# EAGLE board hsa_stm32_board (EAGLE 6.6.0)
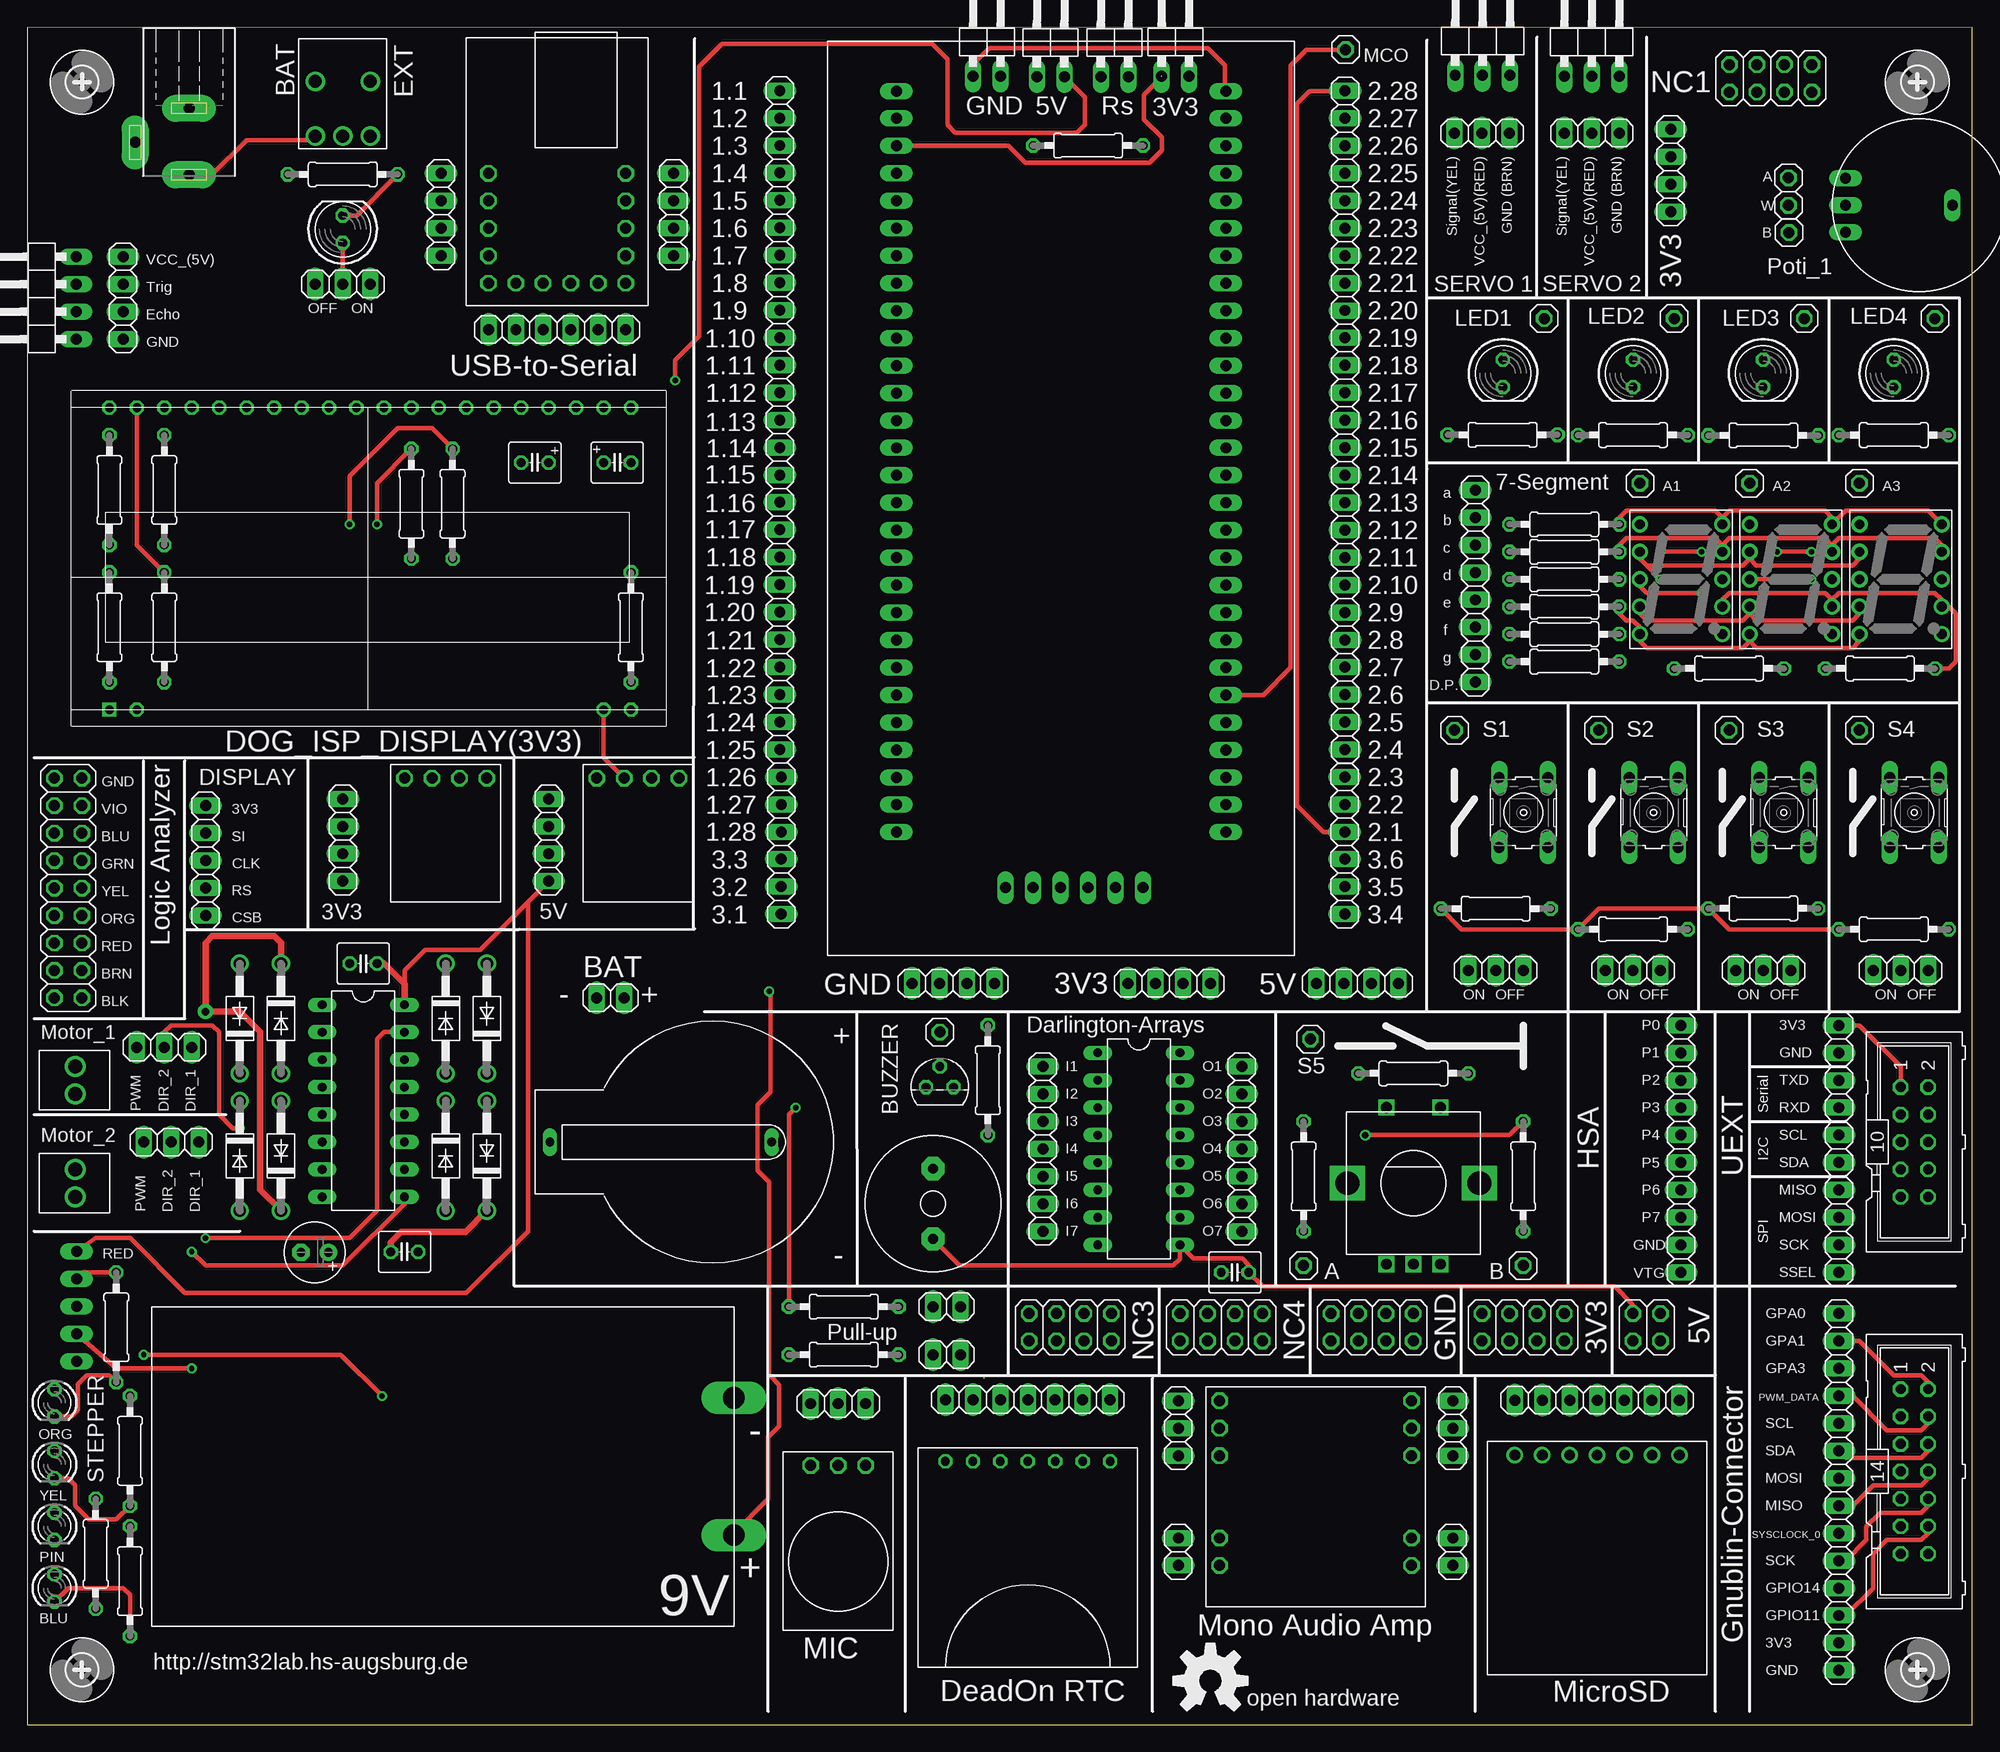
[diagram p3: board, top side]
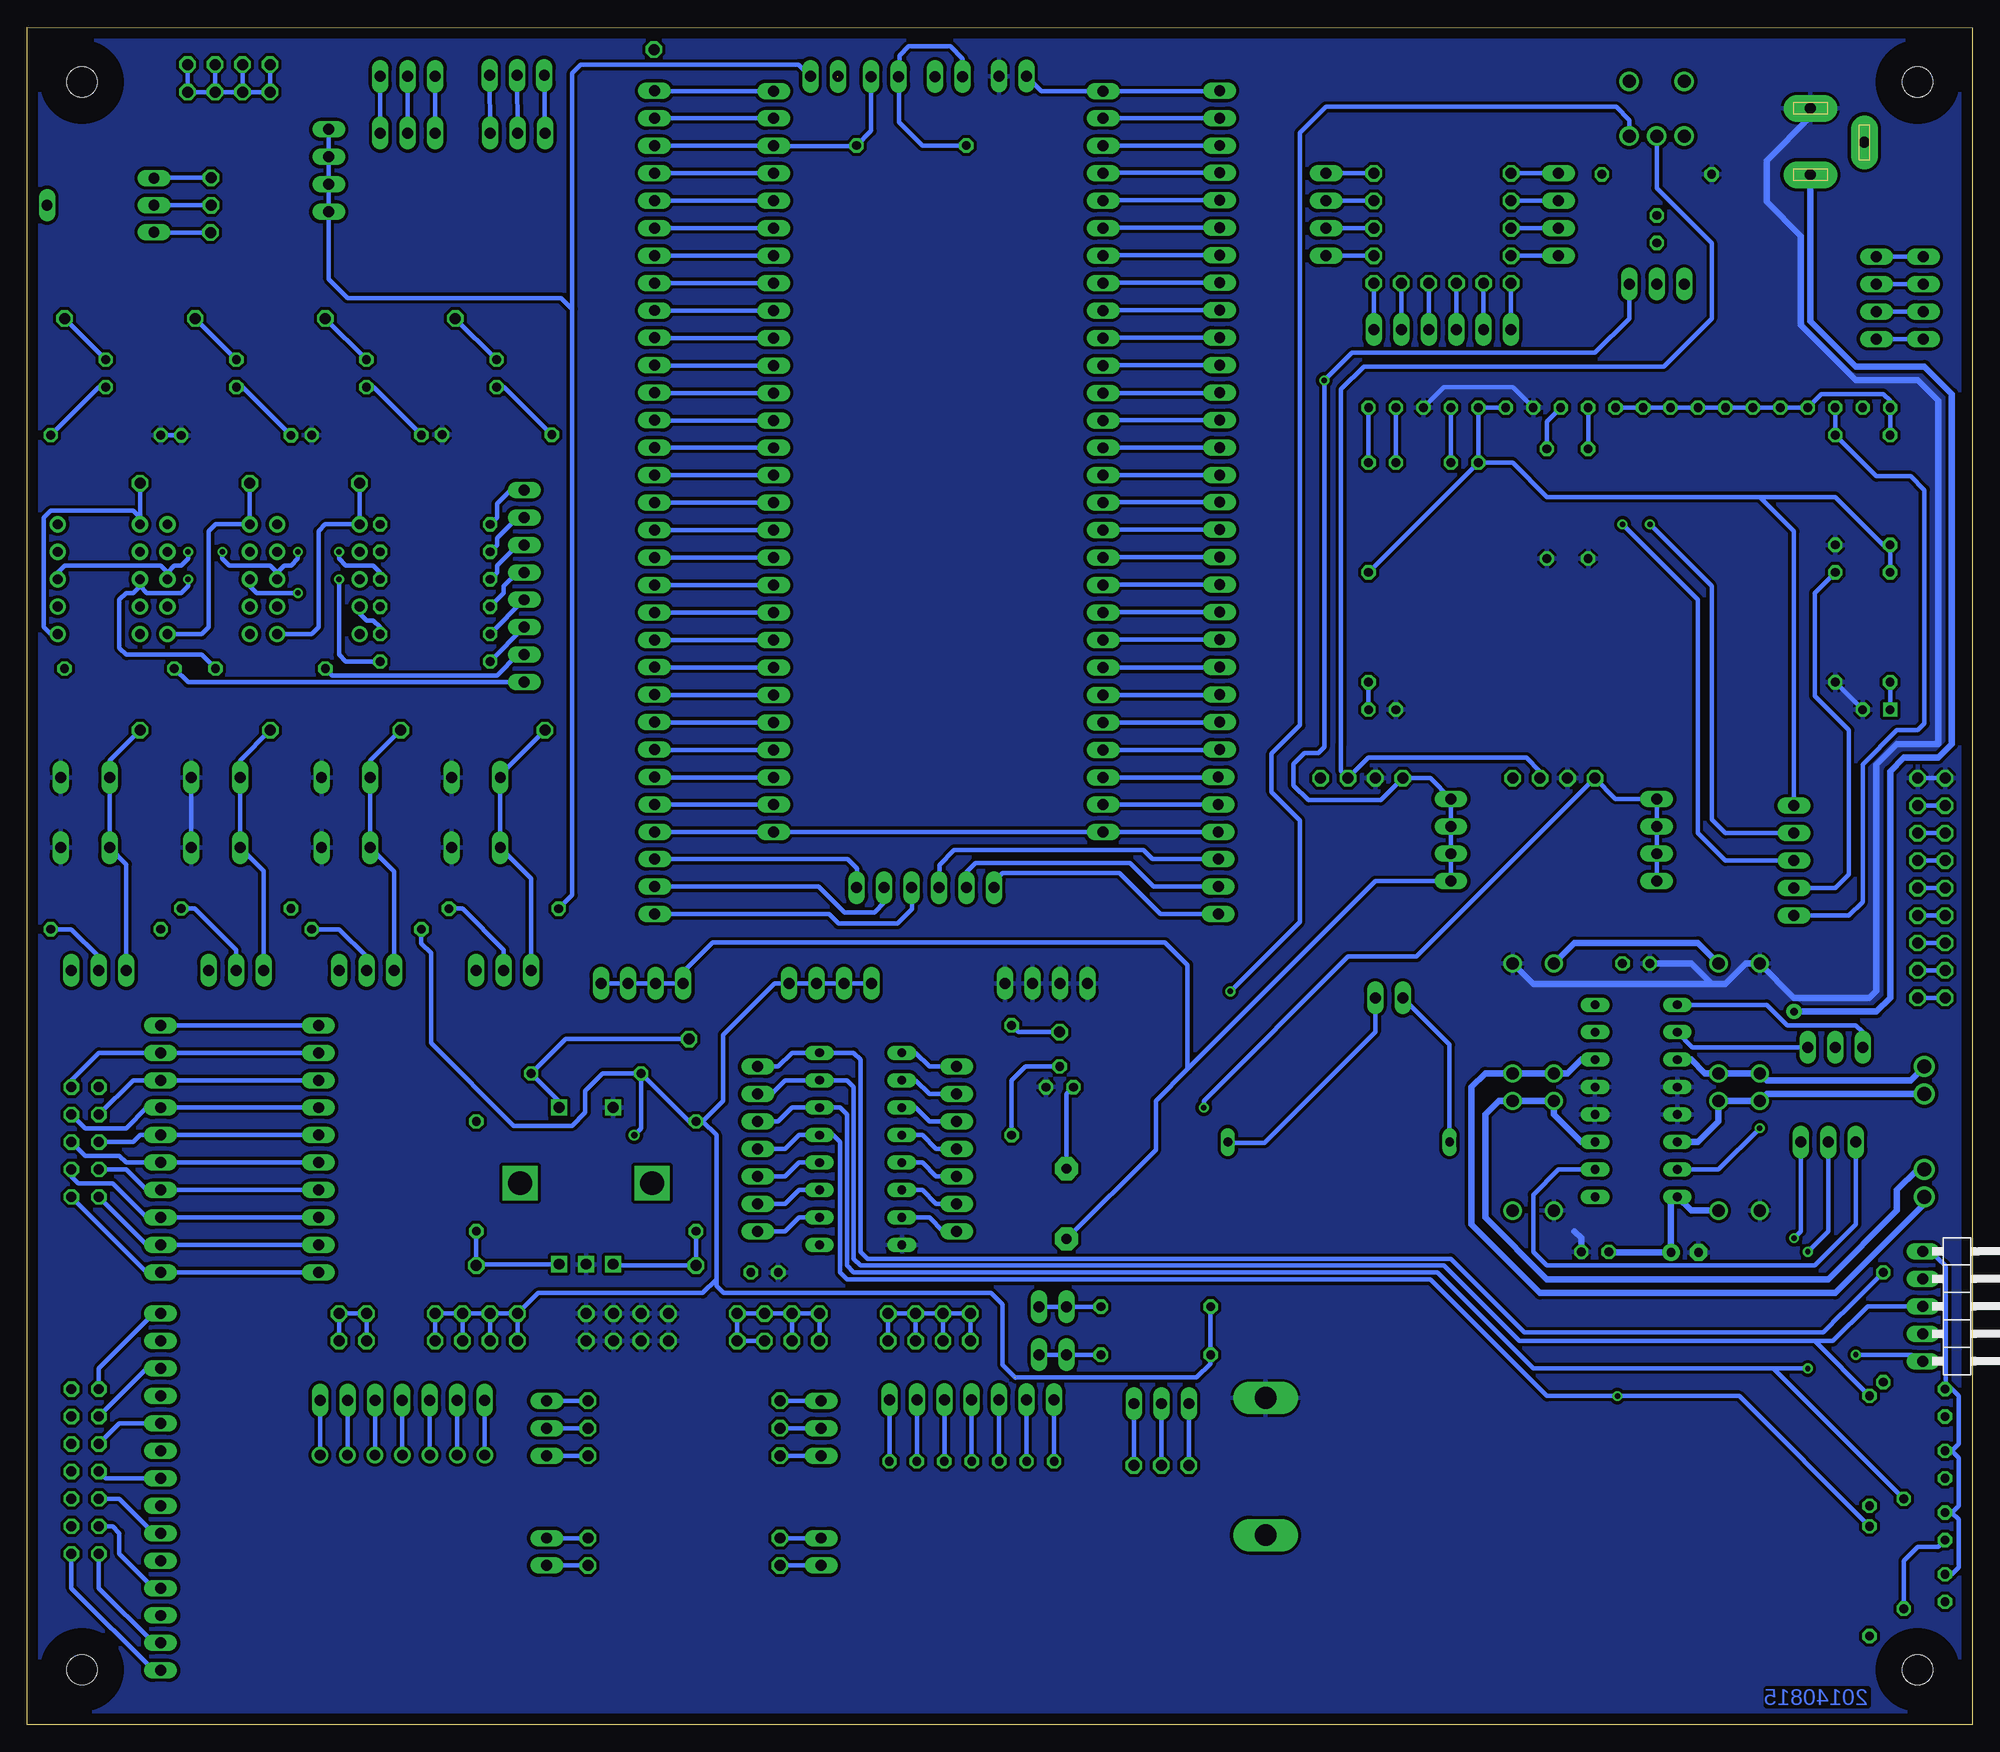
[diagram p4: board, bottom side, seen from below]

Size 180 x 157.08 mm. Coordinates in mm from the lower left corner, seen from the top.
Outline: 0,0 180,0 180,157.08 0,157 0,0
Copper layers (1*16): Top 0.035mm / dielectric 1.5mm / Bottom 0.035mm
Design rules "default *": minimum track width 10mil, minimum drill 0.5mm, track to track 8mil, track to pad 8mil, pad to pad 8mil, via to via 8mil, smd to smd 8mil, copper to edge 40mil, drill to drill 8mil, minimum pad ring 10mil, minimum via ring 8mil, stop-mask expansion 4mil, vias tented up to drill 0mil, thermal gap 10mil

## Footprints (pad centres in the part's own frame; a part is rotated, then mirrored left to right if it is on the bottom)
VOL_REG = drill 1.016 octagon: GND 11.43,6.35; SHDN_N 11.43,1.27; VIN 11.43,3.81; VOUT 11.43,8.89
C025-040X050 = drill 0.813 octagon: 1 -1.27,0; 2 1.27,0
RCL_C025-040X050 = drill 0.813 octagon: 1 -1.27,0; 2 1.27,0
RCL_E2,5-6 = drill 0.813 pad 1.6: + -1.27,0 | drill 0.813 pad 1.6 octagon: - 1.27,0
DO41-10 = drill 1.118: A 5.08,0; C -5.08,0
2,8 = hole 2.8: 0,0
DIL16 = drill 0.813 long: 1 -8.89,-3.81; 2 -6.35,-3.81; 3 -3.81,-3.81; 4 -1.27,-3.81; 5 1.27,-3.81; 6 3.81,-3.81; 7 6.35,-3.81; 8 8.89,-3.81; 9 8.89,3.81; 10 6.35,3.81; 11 3.81,3.81; 12 1.27,3.81; 13 -1.27,3.81; 14 -3.81,3.81; 15 -6.35,3.81; 16 -8.89,3.81
1X05 = drill 1.016 long: 1 -5.08,0; 2 -2.54,0; 3 0,0; 4 2.54,0; 5 5.08,0
1X01 = drill 1.016 octagon: 1 0,0
1X03 = drill 1.016 long: 1 -2.54,0; 2 0,0; 3 2.54,0
1X25 = drill 1.016 long: 1 -29.21,0; 2 -26.67,0; 3 -24.13,0; 4 -21.59,0; 5 -19.05,0; 6 -16.51,0; 7 -13.97,0; 8 -11.43,0; 9 -8.89,0; 10 -6.35,0; 11 -3.81,0; 12 -1.27,0; 13 1.27,0; 14 3.81,0; 15 6.35,0; 16 8.89,0; 17 11.43,0; 18 13.97,0; 19 16.51,0; 20 19.05,0; 21 21.59,0; 22 24.13,0; 23 26.67,0; 24 29.21,0; 25 31.75,0
1X02/90 = drill 1.016 long: 1 -1.27,-3.81; 2 1.27,-3.81
1X10 = drill 1.016 long: 1 -11.43,0; 2 -8.89,0; 3 -6.35,0; 4 -3.81,0; 5 -1.27,0; 6 1.27,0; 7 3.81,0; 8 6.35,0; 9 8.89,0; 10 11.43,0
1X07 = drill 1.016 long: 1 -7.62,0; 2 -5.08,0; 3 -2.54,0; 4 0,0; 5 2.54,0; 6 5.08,0; 7 7.62,0
1X08 = drill 1.016 long: 1 -8.89,0; 2 -6.35,0; 3 -3.81,0; 4 -1.27,0; 5 1.27,0; 6 3.81,0; 7 6.35,0; 8 8.89,0
1X04 = drill 1.016 long: 1 -3.81,0; 2 -1.27,0; 3 1.27,0; 4 3.81,0
1X05/90 = drill 1.016 long: 1 -5.08,-3.81; 2 -2.54,-3.81; 3 0,-3.81; 4 2.54,-3.81; 5 5.08,-3.81
1X04/90 = drill 1.016 long: 1 -3.81,-3.81; 2 -1.27,-3.81; 3 1.27,-3.81; 4 3.81,-3.81
1X02 = drill 1.016 long: 1 -1.27,0; 2 1.27,0
1X06 = drill 1.016 long: 1 -6.35,0; 2 -3.81,0; 3 -1.27,0; 4 1.27,0; 5 3.81,0; 6 6.35,0
2X04 = drill 1.016 octagon: 1 -3.81,-1.27; 2 -3.81,1.27; 3 -1.27,-1.27; 4 -1.27,1.27; 5 1.27,-1.27; 6 1.27,1.27; 7 3.81,-1.27; 8 3.81,1.27
1X03/90 = drill 1.016 long: 1 -2.54,-3.81; 2 0,-3.81; 3 2.54,-3.81
2X09 = drill 1.016 octagon: 1 -10.16,-1.27; 2 -10.16,1.27; 3 -7.62,-1.27; 4 -7.62,1.27; 5 -5.08,-1.27; 6 -5.08,1.27; 7 -2.54,-1.27; 8 -2.54,1.27; 9 0,-1.27; 10 0,1.27; 11 2.54,-1.27; 12 2.54,1.27; 13 5.08,-1.27; 14 5.08,1.27; 15 7.62,-1.27; 16 7.62,1.27; 17 10.16,-1.27; 18 10.16,1.27
1X14 = drill 1.016 long: 1 -16.51,0; 2 -13.97,0; 3 -11.43,0; 4 -8.89,0; 5 -6.35,0; 6 -3.81,0; 7 -1.27,0; 8 1.27,0; 9 3.81,0; 10 6.35,0; 11 8.89,0; 12 11.43,0; 13 13.97,0; 14 16.51,0
2X02 = drill 1.016 octagon: 1 -1.27,-1.27; 2 -1.27,1.27; 3 1.27,-1.27; 4 1.27,1.27
691210910002 = drill 1.3: 1 -2.54,0; 2 0,0
ZEITERFASSUNG_-OPTO_DOGM = drill 0.8 square: 1 0,0 | drill 0.8 octagon: 2 2.54,0; 19 45.72,0; 20 48.26,0; 21 48.26,27.94; 22 45.72,27.94; 23 43.18,27.94; 24 40.64,27.94; 25 38.1,27.94; 26 35.56,27.94; 27 33.02,27.94; 28 30.48,27.94; 29 27.94,27.94; 30 25.4,27.94; 31 22.86,27.94; 32 20.32,27.94; 33 17.78,27.94; 34 15.24,27.94; 35 12.7,27.94; 36 10.16,27.94; 37 7.62,27.94; 38 5.08,27.94; 39 2.54,27.94; 40 0,27.94
LED5MM = drill 0.813 octagon: A -1.27,0; K 1.27,0
LA-401 = drill 0.9 pad 1.5: 1 -3.81,5.08; 2 -3.81,2.54; 3 -3.81,0; 4 -3.81,-2.54; 5 -3.81,-5.08; 6 3.81,-5.08; 7 3.81,-2.54; 8 3.81,0; 9 3.81,2.54; 10 3.81,5.08
LED3MM = drill 0.813 octagon: A -1.27,0; K 1.27,0
0207/10 = drill 0.813 octagon: 1 -5.08,0; 2 5.08,0
CPU-K_MODULE_REV3.0_SWITCH-OMRON_B3F-10XX = drill 1.016 long: 1 -3.251,2.261; 2 3.251,2.261; 3 -3.251,-2.261; 4 3.251,-2.261
BUZZER_F/PMX04A = drill 0.914 pad 2.159 octagon: + 3.251,0; - -3.251,0
CON-HARTING-ML_ML10 = drill 0.914 octagon: 1 -5.08,-1.27; 2 -5.08,1.27; 3 -2.54,-1.27; 4 -2.54,1.27; 5 0,-1.27; 6 0,1.27; 7 2.54,-1.27; 8 2.54,1.27; 9 5.08,-1.27; 10 5.08,1.27
ML14 = drill 0.914 octagon: 1 -7.62,-1.27; 2 -7.62,1.27; 3 -5.08,-1.27; 4 -5.08,1.27; 5 -2.54,-1.27; 6 -2.54,1.27; 7 0,-1.27; 8 0,1.27; 9 2.54,-1.27; 10 2.54,1.27; 11 5.08,-1.27; 12 5.08,1.27; 13 7.62,-1.27; 14 7.62,1.27
ALPS_EC12E_SW = drill 1 square: A -2.5,-7.5; B 2.5,-7.5; C 0,-7.5; D -2.5,7; E 2.5,7 | drill 2.2 square: GND1 -6.1,0; GND2 6.1,0
TRANSISTOR_TO92 = drill 0.813 octagon: 1 1.27,0; 2 0,1.905; 3 -1.27,0
STM32DISCOVERY = drill 1.016 long: 3V3_EXT_VL 11.43,77.08; BOOT0_VL 41.91,69.46; EXT_5V_VL 41.91,77.08; GND_0_L_VL 11.43,82.16; GND_1_L_VL 11.43,13.58; GND_2_R_VL 41.91,82.16; GND_3_R_VL 41.91,13.58; NC_L_VL 11.43,79.62; NC_R_VL 41.91,79.62; PA0_VL 11.43,46.6; PA1_VL 11.43,44.06; PA2_VL 11.43,41.52; PA3_VL 11.43,38.98; PA4_VL 11.43,36.44; PA5_VL 11.43,33.9; PA6_VL 11.43,31.36; PA7_VL 11.43,28.82; PA8_VL 41.91,26.28; PA9_VL 41.91,28.82; PA10_VL 41.91,31.36; PA11_VL 41.91,33.9; PA12_VL 41.91,36.44; PA13_VL 41.91,38.98; PA14_VL 41.91,41.52; PA15_VL 41.91,44.06; PB0_VL 11.43,21.2; PB1_VL 11.43,18.66; PB2_VL 11.43,16.12; PB3_VL 41.91,56.76; PB4_VL 41.91,59.3; PB5_VL 41.91,61.84; PB6_VL 41.91,64.38; PB7_VL 41.91,66.92; PB8_VL 41.91,72; PB9_VL 41.91,74.54; PB10_VL 21.53,8.45; PB11_VL 24.07,8.45; PB12_VL 26.61,8.45; PB13_VL 29.15,8.45; PB14_VL 31.69,8.45; PB15_VL 34.23,8.45; PC0_VL 11.43,56.76; PC1_VL 11.43,54.22; PC2_VL 11.43,51.68; PC3_VL 11.43,49.14; PC4_VL 11.43,26.28; PC5_VL 11.43,23.74; PC6_VL 41.91,16.12; PC7_VL 41.91,18.66; PC8_VL 41.91,21.2; PC9_VL 41.91,23.74; PC10_VL 41.91,46.6; PC11_VL 41.91,49.14; PC12_VL 41.91,51.68; PC13_VL 11.43,72; PC14_VL 11.43,69.46; PC15_VL 11.43,66.92; PD0_VL 11.43,64.38; PD1_VL 11.43,61.84; PD2_VL 41.91,54.22; RESET_VL 11.43,59.3; VBAT_EXT_VL 11.43,74.54
USB_TO_SERIAL = drill 1.016 octagon: 1 12.54,14.75; 2 15.08,14.75; 3 17.62,14.75; 4 20.16,14.75; 5 22.7,14.75; 6 22.7,12.21; 7 22.7,9.67; 8 22.7,7.1; 9 22.7,4.59; 10 22.7,2.05; 11 20.16,2.05; 12 17.62,2.05; 13 15.08,2.05; 14 12.54,2.05
KIPPSCHALTER = drill 1.2: 1 0,0; 2 2.54,0; 3 5.08,0; P$2 0,5.08; P$4 5.08,5.08
MIC = drill 1.016 octagon: 1 1.27,7.62; 2 1.27,5.08; 3 1.27,2.54
BH_KZH_20 = drill 0.8 long: 1 0,24; 2 0,3.5
BATTERIEHALTER_9V = drill 2 long: 1 0,21.135; 2 0,8.435
AUDIO_AMPLIFIER = drill 1.016 octagon: 1 1.27,16.51; 2 1.27,13.97; 3 1.27,6.35; 4 1.27,3.81; 5 1.27,1.27; 6 19.05,16.51; 7 19.05,13.97; 8 19.05,6.35; 9 19.05,3.81; 10 19.05,1.27
RTC = drill 0.8 octagon: 1 2.54,1.27; 2 5.08,1.27; 3 7.62,1.27; 4 10.16,1.27; 5 12.7,1.27; 6 15.24,1.27; 7 17.78,1.27
MIKRO_SD_HALTER = drill 1: 1 20.32,2.54; 2 20.32,5.08; 3 20.32,7.62; 4 20.32,10.16; 5 20.32,12.7; 6 20.32,15.24; 7 20.32,17.78
THUMBWHEEL_POTI = drill 1 long: 1 0,0.6; 2 2.5,0.6; 3 5,0.6; 4 2.5,10.5
733980-62 = drill 1 pad 2.5 long: 1 0,8.57; 2 0,2.42; 3 5,5.57

## Placement (x,y rotation side)
3V3  VOLTAGE_REGULATOR  [VOL_REG]  43.82,76.14 90 top
5V  VOLTAGE_REGULATOR  [VOL_REG]  61.6,76.14 90 top
C2  0.22 u  [C025-040X050]  54.61,116.78 180 top
C3  1 u  [C025-040X050]  46.99,116.78 0 top
C4  100nf  [RCL_C025-040X050]  31.12,70.42 180 top
C5  100nf  [RCL_C025-040X050]  34.93,43.75 0 top
C6  100nf  [RCL_C025-040X050]  111.76,41.85 180 top
C7  100uf  [RCL_E2,5-6]  26.62,43.71 180 top
D1  1N5819  [DO41-10]  42.55,52.64 90 top
D2  1N5819  [DO41-10]  38.74,65.34 270 top
D3  1N5819  [DO41-10]  38.74,52.64 270 top
D4  1N5819  [DO41-10]  42.55,65.34 90 top
D5  1N5819  [DO41-10]  23.5,52.64 90 top
D6  1N5819  [DO41-10]  23.5,65.34 270 top
D7  1N5819  [DO41-10]  19.69,52.64 270 top
D8  1N5819  [DO41-10]  19.69,65.34 90 top
H1  MOUNT-HOLE2.8  [2,8]  174.9,151.98 0 top
H2  MOUNT-HOLE2.8  [2,8]  5.08,151.98 0 top
H3  MOUNT-HOLE2.8  [2,8]  174.9,5.08 0 top
H4  MOUNT-HOLE2.8  [2,8]  5.08,5.08 0 top
IC1  ULN2003AN  [DIL16]  102.87,53.28 270 top
IC2  L293D  [DIL16]  31.12,57.72 270 top
JP1  [1X05]  16.51,79.95 90 top
JP2  [1X01]  118.11,42.48 0 top
JP3  [1X01]  138.43,42.48 0 top
JP4  [1X03]  29.21,133.29 180 top
JP5  [1X01]  140.37,130.11 0 top
JP6  [1X01]  152.41,130.11 0 top
JP7  [1X01]  164.44,130.11 0 top
JP8  [1X01]  176.53,130.11 0 top
JP9  [1X01]  132.08,92.01 0 top
JP10  [1X01]  145.42,92.01 0 top
JP11  [1X01]  157.48,92.01 0 top
JP12  [1X01]  169.55,92.01 0 top
JP13  [1X01]  118.75,63.44 0 top
JP14  [1X25]  121.95,121.97 270 top
JP15  [1X03]  121.92,85.16 270 top
JP16  [1X25]  69.65,119.45 90 top
JP17  [1X01]  84.46,64.07 0 top
JP18  [1X02/90]  94.7,156.3 0 top
JP19  [1X03]  69.79,85.16 90 top
JP20  [1X10]  167.64,53.28 270 top
JP21  [1X07]  112.4,53.28 270 top
JP22  [1X08]  133.99,105.35 90 top
JP23  [1X01]  149.23,114.87 0 top
JP24  [1X04]  8.89,132.02 270 top
JP25  [1X05/90]  0.78,38.71 270 bottom
JP26  [1X07]  93.98,53.28 270 top
JP27  [1X04/90]  0.73,132.02 90 top
JP28  [1X04]  48.26,81.85 90 top
JP29  [1X04]  29.21,81.85 90 top
JP30  [1X03]  75.05,29.71 0 top
JP31  [1X02]  106.52,16 90 top
JP32  [1X02]  131.92,16 270 top
JP33  [1X03]  131.92,27.43 270 top
JP34  [1X03]  106.52,27.43 90 top
JP35  [1X07]  92.59,30.08 0 top
JP36  [1X04]  59.81,139.73 270 top
JP37  [1X04]  38.31,139.73 90 top
JP38  [1X06]  49.04,129.08 180 top
JP39  [1X07]  145.27,30.02 0 top
JP40  [1X04]  123.1,68.59 180 top
JP41  [1X04]  152.08,143.8 270 top
JP42  [1X04]  85.68,68.59 0 top
JP43  [1X02]  53.98,67.25 180 top
JP44  [1X02/90]  88.8,156.35 0 top
JP45  [2X04]  161.33,152.34 0 top
JP46  [1X03]  121.92,77.55 270 top
JP47  [1X04]  105.68,68.59 0 top
JP48  [1X02/90]  106.25,156.33 0 top
JP49  [1X03/90]  134.67,156.41 0 top
JP50  [1X03]  134.62,147.26 180 top
JP51  [1X03/90]  144.78,156.33 0 top
JP52  [1X03]  144.78,147.26 180 top
JP53  [1X01]  163.03,138.07 90 top
JP54  [1X01]  162.97,140.59 90 top
JP55  [1X01]  162.98,143.13 90 top
JP56  [2X09]  3.81,77.41 90 top
JP57  [1X03]  12.7,62.68 0 top
JP58  [1X03]  13.34,53.91 0 top
JP59  [1X03]  173.36,69.79 180 top
JP60  [1X03]  160.66,69.79 180 top
JP61  [1X03]  148.59,69.79 180 top
JP62  [1X03]  135.89,69.79 180 top
JP63  [1X10]  153.04,53.28 270 top
JP64  [1X14]  167.64,21.53 270 top
JP65  [1X02]  85.09,34.23 0 top
JP66  [1X02]  85.09,38.67 0 top
JP67  [2X04]  124.46,36.77 0 top
JP68  [2X04]  96.52,36.77 0 top
JP69  [2X04]  110.49,36.77 0 top
JP70  [2X04]  138.43,36.77 0 top
JP71  [2X02]  149.86,36.77 0 top
JP72  [1X01]  159.39,114.87 0 top
JP73  [1X01]  169.55,114.87 0 top
JP74  [1X03]  69.78,77.54 270 top
JP75  [1X02/90]  100.62,156.3 0 top
K1  691210910002  [691210910002]  4.45,48.83 270 top
K2  691210910002  [691210910002]  4.45,58.36 270 top
LCD1  [ZEITERFASSUNG_-OPTO_DOGM]  7.62,93.92 0 top
LED1  [LED5MM]  136.56,125.03 270 top
LED2  [LED5MM]  148.6,125.03 270 top
LED3  [LED5MM]  160.63,125.03 270 top
LED4  [LED5MM]  172.72,125.03 270 top
LED5  [LED5MM]  29.21,138.37 90 top
LED6  LA-401MD  [LA-401]  163.2,105.98 0 top
LED7  LA-401MD  [LA-401]  173.36,105.98 0 top
LED8  LA-401MD  [LA-401]  153.04,105.98 0 top
LED9  [LED3MM]  2.54,29.78 270 top
LED10  [LED3MM]  2.54,24.07 270 top
LED11  [LED3MM]  2.54,18.35 270 top
LED12  [LED3MM]  2.54,12.64 270 top
LOGO1  OSHW-LOGOL  [OSHW-LOGO-L]  109.49,4.06 0 top
MCO  [1X01]  122,155 0 top
R1  560Ohm  [0207/10]  136.53,119.35 180 top
R2  560Ohm  [0207/10]  148.59,119.32 180 top
R3  560Ohm  [0207/10]  160.66,119.29 180 top
R4  560Ohm  [0207/10]  172.72,119.32 0 top
R5  [0207/10]  98.18,146.11 0 top
R6  1,4K  [0207/10]  29.21,143.45 180 top
R7  1.6  [0207/10]  55.88,101.54 90 top
R8  1,6  [0207/10]  7.62,101.54 90 top
R9  10k  [0207/10]  12.7,101.54 270 top
R10  10k  [0207/10]  7.62,114.24 270 top
R11  10k  [0207/10]  35.56,112.97 90 top
R12  10k  [0207/10]  39.37,112.97 270 top
R13  10k  [0207/10]  12.7,114.24 90 top
R14  10k  [0207/10]  135.89,75.5 180 top
R15  10k  [0207/10]  148.59,73.59 180 top
R16  10k  [0207/10]  160.66,75.53 180 top
R17  10k  [0207/10]  172.72,73.6 180 top
R18  10k  [0207/10]  138.43,50.74 270 top
R19  10k  [0207/10]  118.11,50.74 90 top
R20  10k  [0207/10]  128.27,60.26 0 top
R21  1k  [0207/10]  88.9,59.63 90 top
R22  [0207/10]  75.57,38.67 180 top
R23  [0207/10]  75.57,34.23 180 top
R24  [0207/10]  142.24,111.06 0 top
R25  [0207/10]  142.24,108.52 0 top
R26  [0207/10]  142.24,105.98 0 top
R27  [0207/10]  142.24,103.44 0 top
R28  [0207/10]  142.24,100.9 0 top
R29  [0207/10]  142.24,98.36 0 top
R30  [0207/10]  157.48,97.73 0 top
R31  [0207/10]  171.45,97.73 0 top
R32  [0207/10]  8.26,36.77 270 top
R33  [0207/10]  6.35,15.81 270 top
R34  [0207/10]  9.53,25.34 270 top
R35  [0207/10]  9.53,13.27 270 top
S1  [CPU-K_MODULE_REV3.0_SWITCH-OMRON_B3F-10XX]  138.47,84.39 270 top
S2  [CPU-K_MODULE_REV3.0_SWITCH-OMRON_B3F-10XX]  150.5,84.39 270 top
S3  [CPU-K_MODULE_REV3.0_SWITCH-OMRON_B3F-10XX]  162.54,84.39 270 top
S4  [CPU-K_MODULE_REV3.0_SWITCH-OMRON_B3F-10XX]  174.63,84.39 270 top
SP1  BUZZER_F/PMX04  [BUZZER_F/PMX04A]  83.82,48.2 270 top
SV2  [CON-HARTING-ML_ML10]  174.63,53.91 270 top
SV3  [ML14]  174.63,23.43 270 top
SW1  EC12E_SW  [ALPS_EC12E_SW]  128.27,50.1 0 top
T1  TRANSISTOR_BC337  [TRANSISTOR_TO92]  84.46,58.99 0 top
U$1  STM32DISCOVERY  [STM32DISCOVERY]  69,69 0 top
U$2  USB_TO_SERIAL_ADAPTER  [USB_TO_SERIAL]  40.64,156.08 270 top
U$4  KIPPSCHALTER(EIN,AUS,EIN)  [KIPPSCHALTER]  26.67,146.98 0 top
U$5  MIC  [MIC]  69.97,25.26 270 top
U$6  BATTERIEHALTER  [BH_KZH_20]  72.39,53.91 90 top
U$7  BATTERIEHALTER_9V  [BATTERIEHALTER_9V]  65.41,38.67 180 top
U$9  AUDIO_AMPLIFIER  [AUDIO_AMPLIFIER]  129.38,31.24 180 top
U$10  RTC  [RTC]  102.75,25.63 180 top
U$12  MICRO_SD_HALTER  [MIKRO_SD_HALTER]  155.43,4.62 90 top
U$17  THUMBWHEEL_POTI  [THUMBWHEEL_POTI]  167.65,143.1 270 top
X1  [733980-62]  15,151.98 180 top

## Tracks (layer width: path | path; a pad name or v marks a point on that pad's centre or on a via)
3.3V  (via drill 0.5, 0.6)  (1 unrouted)
  Top 0.406: R17.2 157.5,73.6 R16.2 145.44,75.53 R15.2 132.72,73.59 R14.2 | v123.83,54.55 137.16,54.55 R18.1 | R22.2 70.48,56.45 v71.12,57.09
  Bottom 0.406: JP70.7 JP70.8 JP70.6 | JP70.2 JP70.4 | JP70.4 JP70.6 | JP70.5 JP70.6 | JP70.3 JP70.4 | JP70.1 JP70.2 | R20.1 118.75,55.82 R19.2 117.47,55.82 | R20.1 123.19,55.19 v123.83,54.55 | R22.2 R23.2 70.5,34.21 70.5,33.41 71.79,32.12 88.57,32.12 | JP29.1 JP29.2 JP29.3 JP29.4 33.02,85.67 3V3.VOUT 51.44,71.06 57.78,71.06 71.12,57.73 v71.12,57.09 | 117.47,55.82 116.2,54.55 116.2,41.22 | 116.2,41.22 117.47,39.95 132.72,39.95 JP70.2 | 116.2,41.22 116.2,40.58 115.57,39.95 90.81,39.95 89.75,38.88 89.75,33.3 88.54,32.09 | JP47.1 JP47.2 JP47.3 JP47.4 110.83,68.59 115.59,63.82 115.59,57.7 117.47,55.82 | JP41.1 JP41.2 JP41.3 JP41.4 152.08,133.75 150.34,132.01 130.59,132.01 129.56,130.99 | 129.56,130.99 129.56,76.75 R14.2 | R20.1 126.74,60.27 128.35,58.65 128.35,56.66 129.59,55.42 134.98,55.42 142.62,63.06 142.62,71.39 143.52,72.29 143.52,73.58 R15.2 | 129.56,130.99 129.56,152.82 128.78,153.6 108.6,153.6 JP48.2
3V3_EXT_VL  (1 unrouted)
  Top 0.406: U$1.3V3_EXT_VL 90.81,146.08 92.37,144.53 103.86,144.53 105.01,145.67 105.01,146.86 103.36,148.51 103.36,150.84 105.01,152.49
  Bottom 0.406: JP16.23 80.39,146.12 U$1.3V3_EXT_VL
5V  (via drill 0.5)
  Top 0.406: SP1.+ 86.28,42.48 106.05,42.48 106.68,43.12 IC1.9 107.93,43.14 112.44,43.14 113.03,42.56 C6.1 114.34,40.54 146.9,40.54 148.59,38.85 JP71.2 | 46.35,76.14 46.35,45.66 40.64,39.95 14.61,39.95 9.53,45.02 6.35,45.02 JP25.1 | 46.35,76.14 JP28.1 | 46.35,76.14 41.91,71.69 36.83,71.69 34.92,69.79 34.92,68.52 | v59.97,124.39 59.97,126.27 62.2,128.5 62.2,153.39 64.32,155.51 83.75,155.51 85.15,154.12 85.15,148.05 85.88,147.32 97.12,147.32 97.87,148.06 97.87,150.6 JP18.2
  Top 0.6: C4.1 33.02,70.42 34.92,68.52 IC2.16
  Bottom 0.406: JP71.3 JP71.4 JP71.2 JP71.1 | SP1.+ 75.56,53.2 75.56,57.73 72.63,60.66 | 72.63,60.66 55.24,78.05 JP28.1 JP28.2 JP28.3 JP28.4 50.16,87.57 5V.VOUT 54.74,85.53 61.46,85.53 62.83,86.91 62.83,88.89 61.8,89.91 60.51,89.91 59.97,90.45 v59.97,124.39 57.42,126.94 34.92,126.94 31.75,130.12 JP4.1 | JP25.1 3.81,43.76 3.17,43.12 3.16,43.12 2.49,42.45 2.49,31.64 1.91,31.05 | 1.91,31.05 1.27,30.42 1.27,25.98 1.91,25.34 | 1.91,31.05 LED9.A | LED10.A 1.91,25.34 | 1.91,25.34 1.27,24.7 1.27,20.26 1.91,19.62 | LED11.A 1.91,19.62 | 1.91,19.62 1.27,18.99 1.27,14.54 1.91,13.91 LED12.A | JP40.1 JP40.2 JP40.3 JP40.4 119.29,69.66 116.58,72.36 74.69,72.36 72.63,70.29 72.63,60.66
5V_EXT_VL
  Bottom 0.406: JP14.3 122.04,146.01 122.46,146.01 122.39,146.08 U$1.EXT_5V_VL 110.89,146.06 103.31,146.06 R5.2 101.89,147.48 JP75.2
CLK_DOG  (via drill 0.5)
  Top 0.406: v32.38,111.06 32.38,114.88 R11.2
  Bottom 0.406: R11.2 LCD1.29 | JP1.3 22.86,79.95 25.4,82.49 25.4,104.08 v32.38,111.06
CSB_DOG
  Bottom 0.406: LCD1.38 R13.2 8.89,115.51 5.71,115.51 4.45,114.24 4.45,92.65 5.08,92.02 6.99,92.02 10.16,88.84 10.16,76.14 11.43,74.87 JP1.1
DIR_1_MO_1
  Bottom 0.406: IC2.2 25.91,62.68 JP57.3
DIR_1_MO_2  (via drill 0.5)
  Top 0.406: v16.51,45.02 29.84,45.02 32.38,47.56 32.38,63.44 33.02,64.08 IC2.15
  Bottom 0.406: JP58.3 15.88,45.66 v16.51,45.02
DIR_2_MO_1  (via drill 0.5)
  Top 0.406: v19.68,55.19 19.05,55.19 17.78,56.45 17.78,64.08 17.14,64.71 13.34,64.71 12.7,64.08 JP57.2
  Bottom 0.406: IC2.7 23.5,51.38 v19.68,55.19
DIR_2_MO_2
  Bottom 0.406: JP58.1 10.79,46.3 14.61,42.48 39.37,42.48 40.64,43.76 40.64,48.2 40.63,48.21 40.63,49.04 38.3,51.38 IC2.10 35.56,51.38
GND
  Top 0.406: 5V.GND 53.34,89.47 LCD1.19
  Top 0.6: D3.A 38.73,48.2
  Bottom 0.406: S3.2 S3.1 | LCD1.2 R9.2 | LCD1.27 42.55,123.77 48.9,123.77 LCD1.23 | R3.1 165.76,119.32 R4.1 | JP56.18 JP56.17
  Bottom 0.6: X1.2 15,148.77 19.05,144.72 19.05,140.91 15.88,137.74 15.88,129.48 10.79,124.4 5.08,124.4 3.17,122.5 3.17,90.75 6.99,90.75 8.89,88.84 8.89,67.89 9.53,67.25 16.51,67.25 D8.A 20.95,70.42 22.86,68.52 24.13,68.52 | 24.13,68.52 40.64,68.52 D4.A | 24.13,68.52 26.04,70.42 C4.2 | C5.2 36.2,45.02 36.83,45.66
  pour Bottom (isolate 0.3): -4.28,160.24 194.51,167.48 181.87,-3.12 -4.59,-2.28
GND_BOARD_VL  (via drill 0.6)
  Top 0.406: U$1.GND_2_R_VL 110.84,151.23 110.84,153.54 109.25,155.13 89.01,155.13 87.53,153.66 JP44.1 | v121.95,151.16 118.65,151.16 117.48,149.99 117.48,85.05 119.95,82.58 121.88,82.58 JP15.3
  Bottom 0.406: JP16.25 69.83,151.16 U$1.GND_0_L_VL 86.16,151.16 JP44.1 | JP19.1 69.82,82.58 U$1.GND_1_L_VL U$1.GND_3_R_VL 121.92,82.58 JP15.3 | U$1.GND_2_R_VL v121.95,151.16 JP14.1
GNUB_3V3
  Bottom 0.406: JP64.13 168.28,7.56 173.35,12.64 SV3.13
GNUB_GND
  Bottom 0.406: JP64.14 168.28,5.02 175.9,12.64 SV3.14
GNUB_GPA0
  Bottom 0.406: JP64.1 168.28,38.04 173.35,32.96 SV3.1
GNUB_GPA1
  Top 0.406: SV3.2 175.9,31.69 175.26,32.33 172.72,32.33 169.54,35.5 JP64.2
GNUB_GPA3
  Bottom 0.406: JP64.3 168.91,32.96 SV3.3
GNUB_GPIO11
  Top 0.406: JP64.12 168.28,10.1 170.81,12.64 170.81,15.81 172.09,17.09 175.26,17.09 175.9,17.72 SV3.12
GNUB_GPIO14
  Bottom 0.406: JP64.11 168.28,12.64 171.45,15.81 171.45,17.72 172.09,18.36 SV3.11
GNUB_MISO
  Top 0.406: SV3.8 175.9,22.8 175.26,22.16 170.81,22.16 168.91,20.26 JP64.8
GNUB_MOSI
  Bottom 0.406: JP64.7 172.72,22.8 SV3.7
GNUB_PWM_DATA
  Top 0.406: SV3.4 175.9,27.88 175.26,27.25 172.09,27.25 168.91,30.42 JP64.4
GNUB_SCK
  Top 0.406: JP64.10 168.28,15.18 170.18,17.09 170.18,18.36 171.45,19.62 175.26,19.62 175.9,20.26 SV3.10
GNUB_SCL
  Bottom 0.406: JP64.5 171.45,27.88 SV3.5
GNUB_SDA
  Top 0.406: SV3.6 175.9,25.34 175.26,24.7 168.28,24.7 JP64.6
GNUB_SYSCLOCK_0
  Bottom 0.406: JP64.9 168.28,17.72 171.45,20.89 SV3.9
MCO_VL
  Top 0.406: U$1.PA8_VL 114.39,95.28 116.9,97.8 116.9,153.52 118.37,154.98 121.98,154.98 MCO.1
  Bottom 0.406: U$1.PA8_VL 121.95,95.28 JP14.23
MOTOR_VCC  (via drill 0.7 pad 1.4)
  Top 0.406: X1.1 17.11,143.41 20.32,146.62 26.32,146.62 U$4.1
  Top 0.6: D6.C 23.5,72.33 22.86,72.97 17.14,72.97 16.51,72.33 v16.51,65.98 19.68,65.98 21.59,64.08 21.59,49.47 D5.C | D1.C 40.57,45.59 34.63,45.59 33.66,44.61 C5.1
  Bottom 0.406: 33.66,43.71 C5.1
  Bottom 0.6: X1.1 15,129.88 10.79,125.67 4.45,125.67 1.91,123.13 1.91,90.75 3.17,89.47 6.35,89.47 7.62,88.2 7.62,67.25 8.89,65.98 v16.51,65.98 | D2.C 36.83,72.33 25.4,72.33 D6.C | D5.C 26.04,47.56 IC2.8 27.89,48.25 C7.+ 33.66,43.71
N$1
  Bottom 0.406: C2.2 LCD1.22
N$2
  Bottom 0.406: C2.1 LCD1.21
N$3
  Bottom 0.406: LCD1.20 R7.1
N$4
  Bottom 0.406: R10.1 LCD1.40 7.62,122.5 8.26,123.13 13.97,123.13 LCD1.37 LCD1.36 LCD1.35 LCD1.34 LCD1.33 LCD1.32 LCD1.31 LCD1.30
N$5
  Bottom 0.406: LCD1.1 R8.1
N$6
  Bottom 0.406: C3.2 LCD1.24
N$7
  Bottom 0.406: R4.2 173.35,123.77 LED4.K
N$8
  Bottom 0.406: R3.2 160.04,123.77 LED3.K
N$9
  Bottom 0.406: R2.2 147.95,123.77 LED2.K
N$10
  Bottom 0.406: R1.2 135.85,123.77 LED1.K
N$11
  Bottom 0.406: JP18.1 93.43,154.16 94.55,155.28 98.44,155.28 99.29,154.43 99.29,152.54 JP75.1 99.33,152.47 99.33,148.29 97.16,146.11 R5.1
N$12
  Bottom 0.406: SW1.A 125.77,42.48 JP2.1 R19.1
N$13
  Bottom 0.406: LED2.A JP6.1
N$14
  Bottom 0.406: LED3.A JP7.1
N$15
  Bottom 0.406: LED4.A JP8.1
N$16
  Bottom 0.406: 3V3.VIN 40.01,88.2 41.27,89.47 55.88,89.47 5V.VIN 58.46,88.24 58.46,90.68 58.42,90.72 58.42,123.56 56.31,125.67 28.57,125.67 24.13,130.12 24.13,137.1 29.21,142.18 U$4.2
N$17
  Top 0.406: R32.2 7.61,32.34 5.53,32.34 4.7,31.51 4.7,29.1 4.12,28.52 2.55,28.52 LED9.K
N$18
  Bottom 0.406: JP62.2 135.89,71.69 139.7,75.5 R14.1
N$19
  Bottom 0.406: JP61.2 148.59,71.06 151.13,73.6 R15.1
N$20
  Bottom 0.406: JP9.1 136.21,87.89 S1.3 S1.4 133.35,78.29 JP62.3
N$21
  Bottom 0.406: JP10.1 148.24,89.19 S2.3 S2.4 146.05,78.95 JP61.3
N$22
  Bottom 0.406: JP60.2 160.66,71.69 164.47,75.5 165.71,75.5 R16.1
N$23
  Bottom 0.406: R17.1 175.9,73.6 173.35,71.06 JP59.2
N$24
  Bottom 0.406: JP11.1 160.28,89.22 S3.3 S3.4 158.12,78.98 JP60.3
N$25
  Bottom 0.406: JP12.1 172.37,89.2 S4.3 S4.4 170.81,79.59 JP59.3
N$26
  Top 0.406: R34.2 8.26,18.99 5.71,18.99 4.45,20.26 4.45,22.16 3.81,22.8 LED10.K
N$27  (via drill 0.5)
  Top 0.406: U$7.1 65.41,17.72 68.58,20.89 68.58,26.6 69.59,27.61 69.59,31.46 68.64,32.4 68.64,50.23 67.6,51.27 67.6,57.35 68.81,58.57 68.81,67.7 v68.66,67.85 68.64,67.83
  Bottom 0.406: v68.66,67.85 62.23,74.28 62.23,83.67 64.86,86.3 64.86,89.84 62.22,92.48 62.22,147.3 | 62.24,147.28 62.22,147.3 | 62.22,147.3 59.83,149.68 32.97,149.68 31.75,148.47 U$4.3
N$28
  Top 0.406: LED5.K 30.48,139.64 R6.1
N$29
  Top 0.406: JP4.2 LED5.A
N$30
  Bottom 0.406: LED1.A JP5.1
N$31
  Bottom 0.406: SW1.B 138.43,42.6 | 138.43,42.6 JP3.1 | 138.43,42.6 R18.2
N$32
  Bottom 0.406: SW1.E 130.77,57.69 R20.2 130.18,63.44 JP13.1
N$33
  Bottom 0.406: U$1.NC_R_VL 121.95,148.62 JP14.2
N$35
  Bottom 0.406: U$1.PB9_VL 121.95,143.54 JP14.4
N$36
  Bottom 0.406: SP1.- 83.82,58.36 T1.3
N$37
  Bottom 0.406: JP43.1 55.24,64.1 55.31,64.04 65.5,53.84 68.81,53.84 U$6.2
N$38
  Bottom 0.6: K1.2 4.45,48.2 12.7,39.95 40.01,39.95 46.35,46.3 46.35,58.99 45.09,60.27 D4.C D2.A 37.47,60.27 36.2,61.53 IC2.14
N$39
  Bottom 0.406: JP17.1 88.27,64.08 R21.2
N$40
  Bottom 0.406: U$6.1 48.39,62.94 JP43.2
N$41
  Bottom 0.406: IC1.12 108.58,52.01 109.86,50.74 JP21.5
N$42
  Bottom 0.406: IC1.11 108.58,49.47 109.86,48.2 JP21.6
N$43
  Bottom 0.406: IC1.10 108.58,46.93 109.86,45.66 JP21.7
N$44
  Bottom 0.406: JP26.5 95.89,50.74 97.16,52.01 IC1.5
N$45
  Top 0.406: JP25.2 5.19,41.85 R32.1
  Bottom 0.406: JP21.1 110.49,60.9 109.22,62.17 IC1.16 103.5,62.17 102.87,61.53 102.87,43.76 102.23,43.12 48.26,43.12 41.45,36.31 13.8,36.31 12.07,38.04 12.06,38.04 R32.1
N$46
  Bottom 0.406: 113.03,58.36 JP21.2 111.12,58.36 109.86,59.63 IC1.15 104.14,59.63 103.5,58.99 103.5,43.12 102.87,42.48 48.9,42.48 41.91,35.5 14.61,35.5 | R34.1 14.61,35.5 | 14.61,35.5 12.9,35.5 9.7,38.7 JP25.3
N$47
  Bottom 0.406: JP26.6 95.89,48.2 97.16,49.47 IC1.6
N$48
  Bottom 0.406: JP26.7 95.25,45.66 96.52,46.93 IC1.7
N$49
  Bottom 0.406: JP56.2 JP56.1
N$50
  Bottom 0.406: JP56.4 JP56.3
N$51  (via drill 0.5)
  Top 0.406: JP25.4 8.26,32.96 v15.24,32.96
  Bottom 0.406: JP21.3 110.49,55.82 109.22,57.09 IC1.14 104.78,57.09 104.14,56.45 104.14,42.48 103.5,41.85 49.53,41.85 40.64,32.96 18.41,32.96 | R33.1 18.41,32.96 | v15.24,32.96 18.41,32.96
N$52  (via drill 0.5)
  Top 0.406: v10.79,34.23 29.03,34.23 v32.85,30.41
  Bottom 0.406: JP21.4 109.86,53.28 108.58,54.55 IC1.13 105.41,54.55 104.78,53.91 104.78,41.85 104.14,41.22 50.16,41.22 39.36,30.41 v32.85,30.41 32.84,30.42 21.59,30.42 R35.1 | JP25.5 5.71,34.23 v10.79,34.23
N$53
  Bottom 0.406: JP56.6 JP56.5
N$54
  Bottom 0.406: JP26.4 95.89,53.28 97.16,54.55 IC1.4
N$55
  Bottom 0.406: JP26.3 96.52,55.82 97.79,57.09 IC1.3
N$56
  Bottom 0.406: JP26.2 96.52,58.36 97.79,59.63 IC1.2
N$57
  Bottom 0.406: JP26.1 96.52,60.9 97.79,62.17 IC1.1
N$58
  Bottom 0.406: JP27.1 JP24.4
N$59
  Bottom 0.406: JP56.8 JP56.7
N$60
  Bottom 0.406: JP56.10 JP56.9
N$61
  Bottom 0.406: JP56.12 JP56.11
N$62
  Bottom 0.406: JP27.2 JP24.3
N$63
  Bottom 0.406: JP27.3 JP24.2
N$64
  Bottom 0.406: JP27.4 JP24.1
N$65
  Bottom 0.406: JP32.2 U$9.1
N$66
  Bottom 0.406: JP32.1 U$9.2
N$67
  Bottom 0.406: U$9.6 JP31.1
N$68
  Bottom 0.406: U$9.7 JP31.2
N$69
  Bottom 0.406: U$9.8 JP34.1
N$70
  Bottom 0.406: JP49.3 JP50.1
N$71
  Bottom 0.406: JP49.2 JP50.2
N$72
  Bottom 0.406: JP50.3 JP49.1
N$73
  Bottom 0.406: JP30.1 U$5.3
N$74
  Bottom 0.406: U$5.2 JP30.2
N$75
  Bottom 0.406: U$5.1 JP30.3
N$76
  Bottom 0.406: U$9.9 JP34.2
N$77
  Bottom 0.406: U$9.10 JP34.3
N$78
  Bottom 0.406: JP33.3 U$9.3
N$79
  Bottom 0.406: JP33.2 U$9.4
N$80
  Bottom 0.406: JP33.1 U$9.5
N$81
  Bottom 0.406: U$10.7 JP35.1
N$82
  Bottom 0.406: U$10.6 JP35.2
N$83
  Bottom 0.406: U$10.5 JP35.3
N$84
  Bottom 0.406: U$10.4 JP35.4
N$85
  Bottom 0.406: JP35.5 U$10.3
N$86
  Bottom 0.406: U$10.2 JP35.6
N$87
  Bottom 0.406: JP35.7 U$10.1
N$88
  Bottom 0.406: U$2.1 JP36.1
N$89
  Bottom 0.406: U$2.2 JP36.2
N$90
  Bottom 0.406: U$2.3 JP36.3
N$91
  Bottom 0.406: U$2.4 JP36.4
N$92
  Bottom 0.406: JP37.1 U$2.11
N$93
  Bottom 0.406: JP37.2 U$2.12
N$94
  Bottom 0.406: JP37.3 U$2.13
N$95
  Bottom 0.406: JP37.4 U$2.14
N$96
  Bottom 0.406: JP38.1 U$2.5
N$97
  Bottom 0.406: JP38.2 U$2.6
N$98
  Bottom 0.406: JP38.3 U$2.7
N$99
  Bottom 0.406: JP38.4 47.77,133.35 U$2.8
N$100
  Bottom 0.406: JP38.5 U$2.9
N$101
  Bottom 0.406: JP38.6 U$2.10
N$102
  Bottom 0.406: U$12.7 JP39.1
N$103
  Bottom 0.406: U$12.6 JP39.2
N$104
  Bottom 0.406: U$12.5 JP39.3
N$105
  Bottom 0.406: U$12.4 JP39.4
N$106
  Bottom 0.406: U$12.3 JP39.5
N$107
  Bottom 0.406: U$12.2 JP39.6
N$108
  Bottom 0.406: U$12.1 JP39.7
N$109
  Bottom 0.406: JP51.3 JP52.1
N$110
  Bottom 0.406: JP51.2 JP52.2
N$111
  Bottom 0.406: JP51.1 JP52.3
N$112
  Bottom 0.406: T1.2 87.63,60.9 88.9,59.63 R21.1
N$113
  Bottom 0.6: IC2.11 36.2,53.91 38.73,56.45 D3.C D1.A 43.81,57.73 45.09,56.45 45.09,46.93 39.37,41.22 13.34,41.22 6.99,47.56 6.99,49.47 5.08,51.38 K1.1
N$114
  Bottom 0.406: JP55.1 168.21,143.13 U$17.1
N$115
  Bottom 0.406: JP54.1 U$17.2
N$116
  Bottom 0.6: K2.1 5.71,59.63 19.05,59.63 D8.C D6.A 24.77,60.27 26.04,61.53 IC2.3
N$117
  Bottom 0.6: IC2.6 25.4,53.91 23.5,55.82 D5.A D7.C 19.05,58.36 K2.2
N$118
  Bottom 0.406: JP53.1 168.22,138.07 U$17.3
N$119
  Top 0.406: LED12.K 3.81,12.64 8.89,12.64 9.53,12.01 R35.2
N$120
  Bottom 0.406: LED11.K 3.17,16.45 5.08,16.45 6.35,15.18 R33.2
N$121
  Bottom 0.406: U$1.PB8_VL 121.95,141 JP14.5
N$122
  Bottom 0.406: JP56.14 JP56.13
N$123
  Bottom 0.406: JP56.16 JP56.15
N$125
  Bottom 0.406: R23.1 JP65.1 JP65.2
N$126
  Bottom 0.406: R22.1 JP66.1 JP66.2
N$127
  Bottom 0.406: R24.1 136.53,111.7 136.53,112.97 135.25,114.24 JP22.8
N$129
  Bottom 0.406: U$1.BOOT0_VL 121.95,138.46 JP14.6
N$130
  Bottom 0.406: U$1.PB7_VL 121.95,135.92 JP14.7
N$131
  Top 0.406: R25.2 147.32,109.16 147.96,109.8 156.21,109.8 156.84,109.16 | LED7.9 177.16,109.16 176.53,109.8 167.64,109.8 167,109.16 | 167,109.16 LED6.9 | LED8.9 156.84,109.16 | 156.84,109.16 157.48,109.8 166.37,109.8 167,109.16
N$132
  Bottom 0.406: JP45.8 JP45.7 JP45.5 | JP45.5 JP45.3 | JP45.3 JP45.1 JP45.2 | JP45.6 JP45.5 | JP45.4 JP45.3
N$133  (via drill 0.5)
  Top 0.406: v165.1,108.53 v161.93,108.53 | v154.94,108.53 v151.13,108.53
  Bottom 0.406: LED7.8 177.16,106.62 176.53,107.25 167.64,107.25 167,106.62 | LED6.8 167,106.62 | 156.84,106.62 157.48,107.25 161.29,107.25 161.93,107.89 v161.93,108.53 | 156.84,106.62 LED8.8 | v165.1,108.53 165.1,107.89 165.74,107.25 166.37,107.25 167,106.62 | 156.84,106.62 156.21,107.25 155.57,107.25 154.94,107.89 v154.94,108.53 | v151.13,108.53 151.13,107.89 150.5,107.25 147.96,107.25 147.32,106.62 R26.2
N$134
  Top 0.406: 159.38,100.27 158.75,99.64 149.86,99.64 149.22,100.27 LED8.5 149.22,101.54 148.59,102.17 147.96,102.17 147.32,102.81 R27.2 | LED6.5 159.38,100.27 | 159.38,100.27 160.02,99.64 168.91,99.64 169.54,100.27 LED7.5
N$135
  Top 0.406: 159.38,102.81 160.02,102.17 168.91,102.17 169.54,102.81 LED7.4 | 159.38,102.81 LED6.4 | LED8.4 149.22,102.81 149.86,102.17 158.75,102.17 159.38,102.81
  Bottom 0.406: R28.2 147.32,101.54 147.96,102.17 148.59,102.17 149.22,102.81 LED8.4
N$136
  Bottom 0.406: JP68.3 JP68.4 | JP68.1 JP68.2 JP68.4 | JP68.7 JP68.8 JP68.6 | JP68.4 JP68.6 | JP68.5 JP68.6
N$137
  Bottom 0.406: U$1.PB6_VL 121.95,133.38 JP14.8
N$138
  Bottom 0.406: U$1.PB5_VL 121.95,130.84 JP14.9
N$139  (via drill 0.5)
  Top 0.406: LED7.2 169.54,107.89 168.91,107.25 160.02,107.25 159.38,107.89 | 159.38,107.89 LED6.2 | LED8.2 149.22,107.89 149.86,107.25 | 149.86,107.25 158.75,107.25 159.38,107.89 | v151.13,105.98 149.86,107.25
  Bottom 0.406: v151.13,105.98 151.13,99 150.5,98.36 R29.2
N$140
  Bottom 0.406: JP69.4 JP69.2 JP69.1 | JP69.4 JP69.3 | JP69.4 JP69.6 JP69.8 JP69.7 JP69.5
N$141  (via drill 0.5)
  Top 0.406: v165.1,105.98 LED6.3 | v154.94,104.72 149.86,104.72 149.22,105.35 LED8.3
  Bottom 0.406: LED7.3 169.54,105.35 | 169.54,105.35 168.91,104.72 165.74,104.72 165.1,105.35 v165.1,105.98 | LED6.3 159.38,105.35 158.75,104.72 v154.94,104.72 | R30.2 163.83,99 170.81,99 171.45,99.64 171.45,104.08 170.81,104.72 170.18,104.72 169.54,105.35
N$142
  Top 0.406: 167,104.08 167.64,104.72 176.53,104.72 177.16,104.08 LED7.7 177.8,103.44 178.44,102.81 178.44,98.36 177.8,97.73 R31.2 | LED6.7 167,104.08 | 167,104.08 166.37,104.72 157.48,104.72 156.84,104.08 LED8.7
N$143
  Top 0.406: R24.2 147.32,111.7 147.96,112.33 156.21,112.33 156.84,111.7 | LED8.10 156.84,111.7 | 156.84,111.7 157.48,112.33 166.37,112.33 167,111.7 LED6.10 168.28,112.33 175.9,112.33 LED7.10
N$144
  Bottom 0.406: R25.1 136.53,109.16 136.53,109.8 134.62,111.7 JP22.7
N$145
  Bottom 0.406: R26.1 136.53,106.62 136.53,107.25 134.62,109.16 JP22.6
N$146
  Bottom 0.406: R27.1 135.89,104.72 135.89,105.35 134.62,106.62 JP22.5
N$147
  Bottom 0.406: R28.1 JP22.4
N$148
  Bottom 0.406: R29.1 JP22.3
N$149
  Bottom 0.406: R30.1 151.76,97.09 136.53,97.09 134.62,99 JP22.2
N$150
  Bottom 0.406: R31.1 165.1,96.46 JP22.1
N$151
  Bottom 0.406: JP72.1 LED6.1 162.56,111.06 163.19,110.43 163.19,101.54 163.83,100.91 LED6.6
N$152
  Bottom 0.406: JP73.1 169.54,111.7 | 169.54,111.7 LED7.1 | LED7.6 177.8,100.91 178.44,101.54 178.44,111.7 177.8,112.33 170.18,112.33 169.54,111.7
N$153
  Bottom 0.406: JP23.1 LED8.1 152.4,111.06 153.03,110.43 153.03,101.54 153.67,100.91 LED8.6
N$154
  Bottom 0.406: U$1.PB4_VL 121.95,128.3 JP14.10
N$155
  Bottom 0.406: U$1.PB3_VL 121.95,125.76 JP14.11
N$156
  Bottom 0.406: U$1.PD2_VL 121.95,123.22 JP14.12
N$157
  Bottom 0.406: U$1.PC12_VL 121.95,120.68 JP14.13
N$158
  Bottom 0.406: U$1.PC11_VL 121.95,118.14 JP14.14
N$159
  Bottom 0.406: U$1.PC10_VL 121.95,115.6 JP14.15
N$160
  Bottom 0.406: U$1.PA15_VL 121.95,113.06 JP14.16
N$161
  Bottom 0.406: U$1.PA14_VL 121.95,110.52 JP14.17
N$162
  Bottom 0.406: U$1.PA13_VL 121.95,107.98 JP14.18
N$163
  Bottom 0.406: U$1.PA12_VL 121.95,105.44 JP14.19
N$164
  Bottom 0.406: U$1.PA11_VL 121.95,102.9 JP14.20
N$165
  Bottom 0.406: U$1.PA10_VL 121.95,100.36 JP14.21
N$166
  Bottom 0.406: U$1.PA9_VL 121.95,97.82 JP14.22
N$168
  Bottom 0.406: U$1.PC9_VL 121.95,92.74 JP14.24
N$169
  Bottom 0.406: U$1.PC8_VL 121.95,90.2 JP14.25
N$170
  Bottom 0.406: U$1.PC7_VL 121.92,87.66 JP15.1
N$171
  Bottom 0.406: U$1.PC6_VL 121.92,85.12 JP15.2
N$173
  Bottom 0.406: U$1.PB0_VL 69.83,90.2 JP16.1
N$174
  Bottom 0.406: U$1.PC5_VL 69.83,92.74 JP16.2
N$175
  Bottom 0.406: U$1.PC4_VL 69.83,95.28 JP16.3
N$176
  Bottom 0.406: U$1.PA7_VL 69.83,97.82 JP16.4
N$177
  Bottom 0.406: JP16.5 80.39,100.4 U$1.PA6_VL
N$178
  Bottom 0.406: JP16.6 80.39,102.94 U$1.PA5_VL
N$179
  Bottom 0.406: JP16.7 80.39,105.48 U$1.PA4_VL
N$180
  Bottom 0.406: JP16.8 80.39,108.02 U$1.PA3_VL
N$181
  Bottom 0.406: JP16.9 80.39,110.56 U$1.PA2_VL
N$182
  Bottom 0.406: JP16.10 80.39,113.1 U$1.PA1_VL
N$183
  Bottom 0.406: JP16.11 80.39,115.64 U$1.PA0_VL
N$184
  Bottom 0.406: JP16.12 80.39,118.18 U$1.PC3_VL
N$185
  Bottom 0.406: JP16.13 80.39,120.72 U$1.PC2_VL
N$186
  Bottom 0.406: U$1.PC1_VL 69.83,123.22 JP16.14
N$187
  Bottom 0.406: JP16.15 80.39,125.8 U$1.PC0_VL
N$188
  Bottom 0.406: JP16.16 80.39,128.34 U$1.RESET_VL
N$189
  Bottom 0.406: JP16.17 80.39,130.88 U$1.PD1_VL
N$190
  Bottom 0.406: JP16.18 80.39,133.42 U$1.PD0_VL
N$191
  Bottom 0.406: JP16.19 80.39,135.96 U$1.PC15_VL
N$192
  Bottom 0.406: JP16.20 80.39,138.5 U$1.PC14_VL
N$193
  Bottom 0.406: JP16.21 80.39,141.04 U$1.PC13_VL
N$194
  Bottom 0.406: JP16.22 80.39,143.58 U$1.VBAT_EXT_VL
N$196
  Bottom 0.406: JP16.24 80.39,148.66 U$1.NC_L_VL
N$199
  Bottom 0.406: U$1.PB2_VL 69.82,85.12 JP19.2
N$200
  Bottom 0.406: U$1.PB1_VL 69.82,87.66 JP19.3
N$201
  Bottom 0.406: JP46.1 104.07,80.09 103.21,79.23 103.21,77.47 U$1.PB15_VL
N$202
  Bottom 0.406: JP46.2 106.75,77.55 104.36,75.16 101.6,75.16 100.64,76.12 100.64,77.4 U$1.PB14_VL
N$203
  Bottom 0.406: JP46.3 105.82,75.01 104.93,74.12 99.46,74.12 98.1,75.48 98.1,77.4 U$1.PB13_VL
N$204
  Bottom 0.406: JP74.1 75.86,80.08 76.72,80.93 94.22,80.93 95.59,79.56 95.59,77.47 U$1.PB12_VL
N$205
  Bottom 0.406: U$1.PB11_VL 93.07,78.91 92.25,79.73 77.96,79.73 75.77,77.54 JP74.2
N$206
  Bottom 0.406: JP74.3 75.13,75.01 78.94,78.83 89.75,78.83 90.53,78.04 U$1.PB10_VL
PWM_MO_1
  Bottom 0.406: IC2.1 19.05,66.61 17.14,64.71 10.79,64.71 10.16,64.08 JP57.1
PWM_MO_2  (via drill 0.5)
  Top 0.406: v15.24,43.76 16.51,42.48 29.21,42.48 34.92,48.2 IC2.9
  Bottom 0.406: JP58.2 13.34,45.66 v15.24,43.76
RS_DOG
  Top 0.406: LCD1.39 10.16,109.16 R9.1
  Bottom 0.406: JP1.2 12.7,77.41 11.43,78.68 11.43,92.02 14.61,95.19 14.61,104.72 R9.1
SI_DOG  (via drill 0.5)
  Top 0.406: v29.84,111.06 29.84,115.51 34.29,119.95 37.47,119.95 R12.1
  Bottom 0.406: R12.1 39.37,120.59 LCD1.28 | JP1.4 22.86,82.49 24.13,83.76 24.13,105.35 v29.84,111.06
UEXT_3V3
  Top 0.406: SV2.1 173.35,60.9 169.54,64.71 JP20.1
  Bottom 0.406: JP63.1 JP20.1
UEXT_GND
  Bottom 0.406: JP63.2 JP20.2 173.35,62.17 175.9,59.63 SV2.2
UEXT_MISO
  Bottom 0.406: JP63.7 JP20.7 168.91,49.47 170.81,51.38 SV2.7
UEXT_MOSI
  Bottom 0.406: JP63.8 JP20.8 168.91,46.93 172.09,50.1 175.26,50.1 175.9,50.74 SV2.8
UEXT_RXD
  Bottom 0.406: JP63.4 JP20.4 168.91,57.09 170.81,55.19 174.62,55.19 SV2.4
UEXT_SCK
  Bottom 0.406: JP63.9 JP20.9 168.91,44.39 SV2.9
UEXT_SCL
  Bottom 0.406: JP63.5 JP20.5 169.54,54.55 170.18,53.91 SV2.5
UEXT_SDA
  Bottom 0.406: JP63.6 JP20.6 170.81,52.01 171.45,52.65 174.62,52.65 SV2.6
UEXT_SSEL
  Bottom 0.406: JP63.10 JP20.10 168.91,41.85 SV2.10
UEXT_TXD
  Bottom 0.406: JP63.3 JP20.3 170.18,59.63 SV2.3
V3V_DOG
  Bottom 0.406: R8.2 R10.2 8.26,109.16 12.7,113.61 19.68,113.61 | JP1.5 16.51,110.43 19.68,113.61 | 19.68,113.61 39.37,113.61 42.55,116.78 C3.1 | LCD1.26 LCD1.25 C3.1 | R7.2 C3.1

## Text on the board
Bottom: 20140815
tPlace: BAT | EXT | NC1 | 1.1 | 2.28 | GND | 5V | Rs | 3V3 | 1.2 | 2.27 | 1.3 | 2.26 | 1.4 | 2.25 | 1.5 | 2.24 | 1.6 | 2.23 | 1.7 | 2.22 | 1.8 | 2.21 | 3V3 | 1.9 | 2.20 | LED2 | LED4 | LED1 | LED3 | 1.10 | 2.19 | USB-to-Serial | 1.11 | 2.18 | 1.12 | 2.17 | 1.13 | 2.16 | + | + | 1.14 | 2.15 | 1.15 | 2.14 | 7-Segment | 1.16 | 2.13 | 1.17 | 2.12 | 1.18 | 2.11 | 1.19 | 2.10 | 1.20 | 2.9 | 2.8 | 1.21 | 1.22 | 2.7 | 1.23 | 2.6 | 1.24 | 2.5 | S1 | S2 | S3 | S4 | DOG_ISP_DISPLAY(3V3) | Logic Analyzer | 1.25 | 2.4 | GND | DISPLAY | 1.26 | 2.3 | VIO | 3V3 | 1.27 | 2.2 | BLU | SI | 1.28 | 2.1 | GRN | CLK | 3.3 | 3.6 | YEL | RS | 3.2 | 3.5 | 5V | ORG | CSB | 3V3 | 3.1 | 3.4 | RED | GND | 3V3 | 5V | BRN | BAT | - | + | BLK | Darlington-Arrays | Motor_1 | + | S5 | PWM | DIR_2 | DIR_1 | BUZZER | Motor_2 | HSA | UEXT | PWM | DIR_2 | DIR_1 | RED | - | A | B | GND | NC3 | NC4 | 3V3 | 5V | Pull-up | ORG | YEL | PIN | 9V | Mono Audio Amp | BLU | MIC | Gnublin-Connector | http://stm32lab.hs-augsburg.de | DeadOn RTC | MicroSD | open hardware
tNames: Signal(YEL) | VCC_(5V)(RED) | GND (BRN) | Signal(YEL) | VCC_(5V)(RED) | GND (BRN) | A | W | B | VCC_(5V) | Poti_1 | Trig | SERVO 1 | SERVO 2 | OFF | ON | Echo | GND | A1 | A2 | A3 | a | b | c | d | e | f | g | D.P. | ON | OFF | ON | OFF | ON | OFF | ON | OFF | P0 | 3V3 | P1 | GND | I1 | O1 | P2 | TXD | I2 | O2 | P3 | Serial | RXD | I3 | O3 | P4 | SCL | I4 | O4 | P5 | I2C | SDA | I5 | O5 | P6 | MISO | I6 | O6 | P7 | MOSI | I7 | O7 | SPI | GND | SCK | VTG | SSEL | GPA0 | GPA1 | GPA3 | PWM_DATA | SCL | SDA | STEPPER | MOSI | MISO | SYSCLOCK_0 | SCK | GPIO14 | GPIO11 | 3V3 | GND